# EAGLE design SMR (EAGLE 8.3.2)
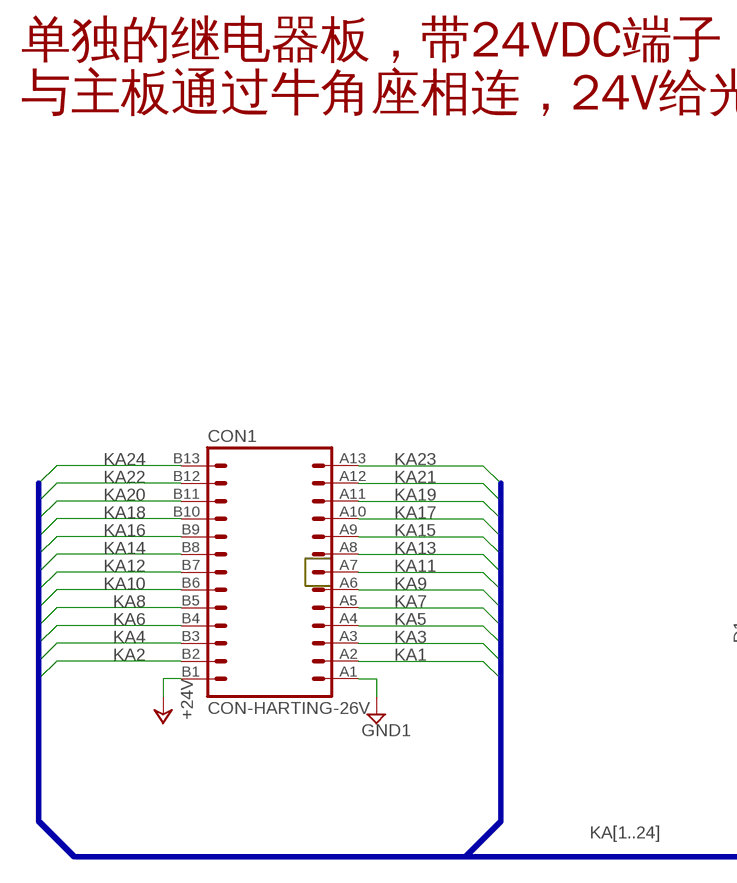
[diagram p0: schematic, sheet 1, part 1 of 2]
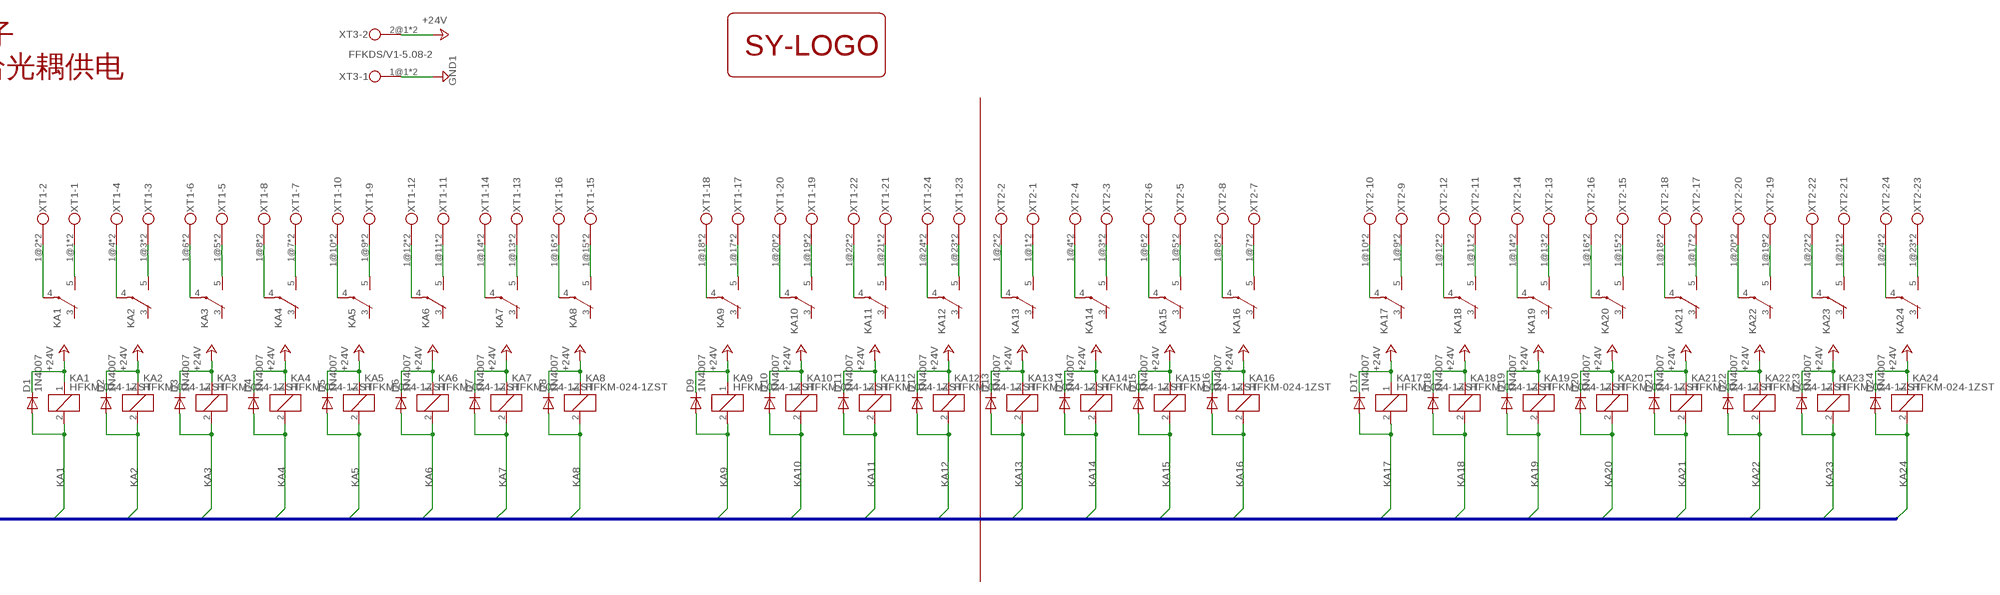
[diagram p1: schematic, sheet 1, part 2 of 2]

## Parts
CON1  CON-HARTING-26V  [26V]
D1  1N4007  [DO41-10]
D2  1N4007  [DO41-10]
D3  1N4007  [DO41-10]
D4  1N4007  [DO41-10]
D5  1N4007  [DO41-10]
D6  1N4007  [DO41-10]
D7  1N4007  [DO41-10]
D8  1N4007  [DO41-10]
D9  1N4007  [DO41-10]
D10  1N4007  [DO41-10]
D11  1N4007  [DO41-10]
D12  1N4007  [DO41-10]
D13  1N4007  [DO41-10]
D14  1N4007  [DO41-10]
D15  1N4007  [DO41-10]
D16  1N4007  [DO41-10]
D17  1N4007  [DO41-10]
D18  1N4007  [DO41-10]
D19  1N4007  [DO41-10]
D20  1N4007  [DO41-10]
D21  1N4007  [DO41-10]
D22  1N4007  [DO41-10]
D23  1N4007  [DO41-10]
D24  1N4007  [DO41-10]
KA1  HFKM-024-1ZST  [HFKM-1ZST]
KA2  HFKM-024-1ZST  [HFKM-1ZST]
KA3  HFKM-024-1ZST  [HFKM-1ZST]
KA4  HFKM-024-1ZST  [HFKM-1ZST]
KA5  HFKM-024-1ZST  [HFKM-1ZST]
KA6  HFKM-024-1ZST  [HFKM-1ZST]
KA7  HFKM-024-1ZST  [HFKM-1ZST]
KA8  HFKM-024-1ZST  [HFKM-1ZST]
KA9  HFKM-024-1ZST  [HFKM-1ZST]
KA10  HFKM-024-1ZST  [HFKM-1ZST]
KA11  HFKM-024-1ZST  [HFKM-1ZST]
KA12  HFKM-024-1ZST  [HFKM-1ZST]
KA13  HFKM-024-1ZST  [HFKM-1ZST]
KA14  HFKM-024-1ZST  [HFKM-1ZST]
KA15  HFKM-024-1ZST  [HFKM-1ZST]
KA16  HFKM-024-1ZST  [HFKM-1ZST]
KA17  HFKM-024-1ZST  [HFKM-1ZST]
KA18  HFKM-024-1ZST  [HFKM-1ZST]
KA19  HFKM-024-1ZST  [HFKM-1ZST]
KA20  HFKM-024-1ZST  [HFKM-1ZST]
KA21  HFKM-024-1ZST  [HFKM-1ZST]
KA22  HFKM-024-1ZST  [HFKM-1ZST]
KA23  HFKM-024-1ZST  [HFKM-1ZST]
KA24  HFKM-024-1ZST  [HFKM-1ZST]
LOGO1  SY-LOGO_BOTTOM  [SY-LOGO_BOTTOM]
XT1  FFKDS/V1-5.08-24  [FFKDS/V1-5.08-24]
XT2  FFKDS/V1-5.08-24  [FFKDS/V1-5.08-24]
XT3  FFKDS/V1-5.08-2  [FFKDS/V1-5.08-2]

## Nets
+24V: CON1.B1 D1.C D2.C D3.C D4.C D5.C D6.C D7.C D8.C D9.C D10.C D11.C D12.C D13.C D14.C D15.C D16.C D17.C D18.C D19.C D20.C D21.C D22.C D23.C D24.C KA1.1(COIL1) KA2.1(COIL1) KA3.1(COIL1) KA4.1(COIL1) KA5.1(COIL1) KA6.1(COIL1) KA7.1(COIL1) KA8.1(COIL1) KA9.1(COIL1) KA10.1(COIL1) KA11.1(COIL1) KA12.1(COIL1) KA13.1(COIL1) KA14.1(COIL1) KA15.1(COIL1) KA16.1(COIL1) KA17.1(COIL1) KA18.1(COIL1) KA19.1(COIL1) KA20.1(COIL1) KA21.1(COIL1) KA22.1(COIL1) KA23.1(COIL1) KA24.1(COIL1) XT3.2@1 XT3.2@2
GND1: CON1.A1 XT3.1@1 XT3.1@2
KA1: CON1.A2 D1.A KA1.2(COIL2)
KA2: CON1.B2 D2.A KA2.2(COIL2)
KA3: CON1.A3 D3.A KA3.2(COIL2)
KA4: CON1.B3 D4.A KA4.2(COIL2)
KA5: CON1.A4 D5.A KA5.2(COIL2)
KA6: CON1.B4 D6.A KA6.2(COIL2)
KA7: CON1.A5 D7.A KA7.2(COIL2)
KA8: CON1.B5 D8.A KA8.2(COIL2)
KA9: CON1.A6 D9.A KA9.2(COIL2)
KA10: CON1.B6 D10.A KA10.2(COIL2)
KA11: CON1.A7 D11.A KA11.2(COIL2)
KA12: CON1.B7 D12.A KA12.2(COIL2)
KA13: CON1.A8 D13.A KA13.2(COIL2)
KA14: CON1.B8 D14.A KA14.2(COIL2)
KA15: CON1.A9 D15.A KA15.2(COIL2)
KA16: CON1.B9 D16.A KA16.2(COIL2)
KA17: CON1.A10 D17.A KA17.2(COIL2)
KA18: CON1.B10 D18.A KA18.2(COIL2)
KA19: CON1.A11 D19.A KA19.2(COIL2)
KA20: CON1.B11 D20.A KA20.2(COIL2)
KA21: CON1.A12 D21.A KA21.2(COIL2)
KA22: CON1.B12 D22.A KA22.2(COIL2)
KA23: CON1.A13 D23.A KA23.2(COIL2)
KA24: CON1.B13 D24.A KA24.2(COIL2)
N$1: KA1.4(COM) XT1.1@2 XT1.2@2
N$2: KA1.5(NO) XT1.1@1 XT1.2@1
N$3: KA3.4(COM) XT1.1@6 XT1.2@6
N$4: KA3.5(NO) XT1.1@5 XT1.2@5
N$51: KA8.5(NO) XT1.1@15 XT1.2@15
N$52: KA8.4(COM) XT1.1@16 XT1.2@16
N$53: KA7.5(NO) XT1.1@13 XT1.2@13
N$54: KA7.4(COM) XT1.1@14 XT1.2@14
N$55: KA6.5(NO) XT1.1@11 XT1.2@11
N$56: KA6.4(COM) XT1.1@12 XT1.2@12
N$57: KA5.5(NO) XT1.1@9 XT1.2@9
N$58: KA5.4(COM) XT1.1@10 XT1.2@10
N$59: KA4.5(NO) XT1.1@7 XT1.2@7
N$60: KA4.4(COM) XT1.1@8 XT1.2@8
N$63: KA2.5(NO) XT1.1@3 XT1.2@3
N$64: KA2.4(COM) XT1.1@4 XT1.2@4
N$89: KA9.4(COM) XT1.1@18 XT1.2@18
N$90: KA9.5(NO) XT1.1@17 XT1.2@17
N$91: KA16.5(NO) XT2.1@7 XT2.2@7
N$92: KA16.4(COM) XT2.1@8 XT2.2@8
N$93: KA15.5(NO) XT2.1@5 XT2.2@5
N$94: KA15.4(COM) XT2.1@6 XT2.2@6
N$95: KA14.5(NO) XT2.1@3 XT2.2@3
N$96: KA14.4(COM) XT2.1@4 XT2.2@4
N$97: KA13.5(NO) XT2.1@1 XT2.2@1
N$98: KA13.4(COM) XT2.1@2 XT2.2@2
N$99: KA12.5(NO) XT1.1@23 XT1.2@23
N$100: KA12.4(COM) XT1.1@24 XT1.2@24
N$101: KA11.5(NO) XT1.1@21 XT1.2@21
N$102: KA11.4(COM) XT1.1@22 XT1.2@22
N$103: KA10.5(NO) XT1.1@19 XT1.2@19
N$104: KA10.4(COM) XT1.1@20 XT1.2@20
N$129: KA17.4(COM) XT2.1@10 XT2.2@10
N$130: KA17.5(NO) XT2.1@9 XT2.2@9
N$131: KA24.5(NO) XT2.1@23 XT2.2@23
N$132: KA24.4(COM) XT2.1@24 XT2.2@24
N$133: KA23.5(NO) XT2.1@21 XT2.2@21
N$134: KA23.4(COM) XT2.1@22 XT2.2@22
N$135: KA22.5(NO) XT2.1@19 XT2.2@19
N$136: KA22.4(COM) XT2.1@20 XT2.2@20
N$137: KA21.5(NO) XT2.1@17 XT2.2@17
N$138: KA21.4(COM) XT2.1@18 XT2.2@18
N$139: KA20.5(NO) XT2.1@15 XT2.2@15
N$140: KA20.4(COM) XT2.1@16 XT2.2@16
N$141: KA19.5(NO) XT2.1@13 XT2.2@13
N$142: KA19.4(COM) XT2.1@14 XT2.2@14
N$143: KA18.5(NO) XT2.1@11 XT2.2@11
N$144: KA18.4(COM) XT2.1@12 XT2.2@12
Unconnected: KA1.3(NC) KA2.3(NC) KA3.3(NC) KA4.3(NC) KA5.3(NC) KA6.3(NC) KA7.3(NC) KA8.3(NC) KA9.3(NC) KA10.3(NC) KA11.3(NC) KA12.3(NC) KA13.3(NC) KA14.3(NC) KA15.3(NC) KA16.3(NC) KA17.3(NC) KA18.3(NC) KA19.3(NC) KA20.3(NC) KA21.3(NC) KA22.3(NC) KA23.3(NC) KA24.3(NC)

## Buses
KA[1..24]

## Notes on the sheet
- 单独的继电器板，带24VDC端子
  与主板通过牛角座相连，24V给光耦供电

## Library data of the parts
CON1 = SHMT:CON-HARTING-26V: CONNECTOR; OC_FARNELL: unknown; OC_NEWARK: unknown
D1-D24 = SHMT:1N4007
KA1-KA24 = prj_snowmaker:HFKM-024-1ZST
LOGO1 = LOGO:SY-LOGO
XT1 XT2 = SHMT:FFKDS/V1-5.08-24
XT3 = SHMT:FFKDS/V1-5.08-2

## Board
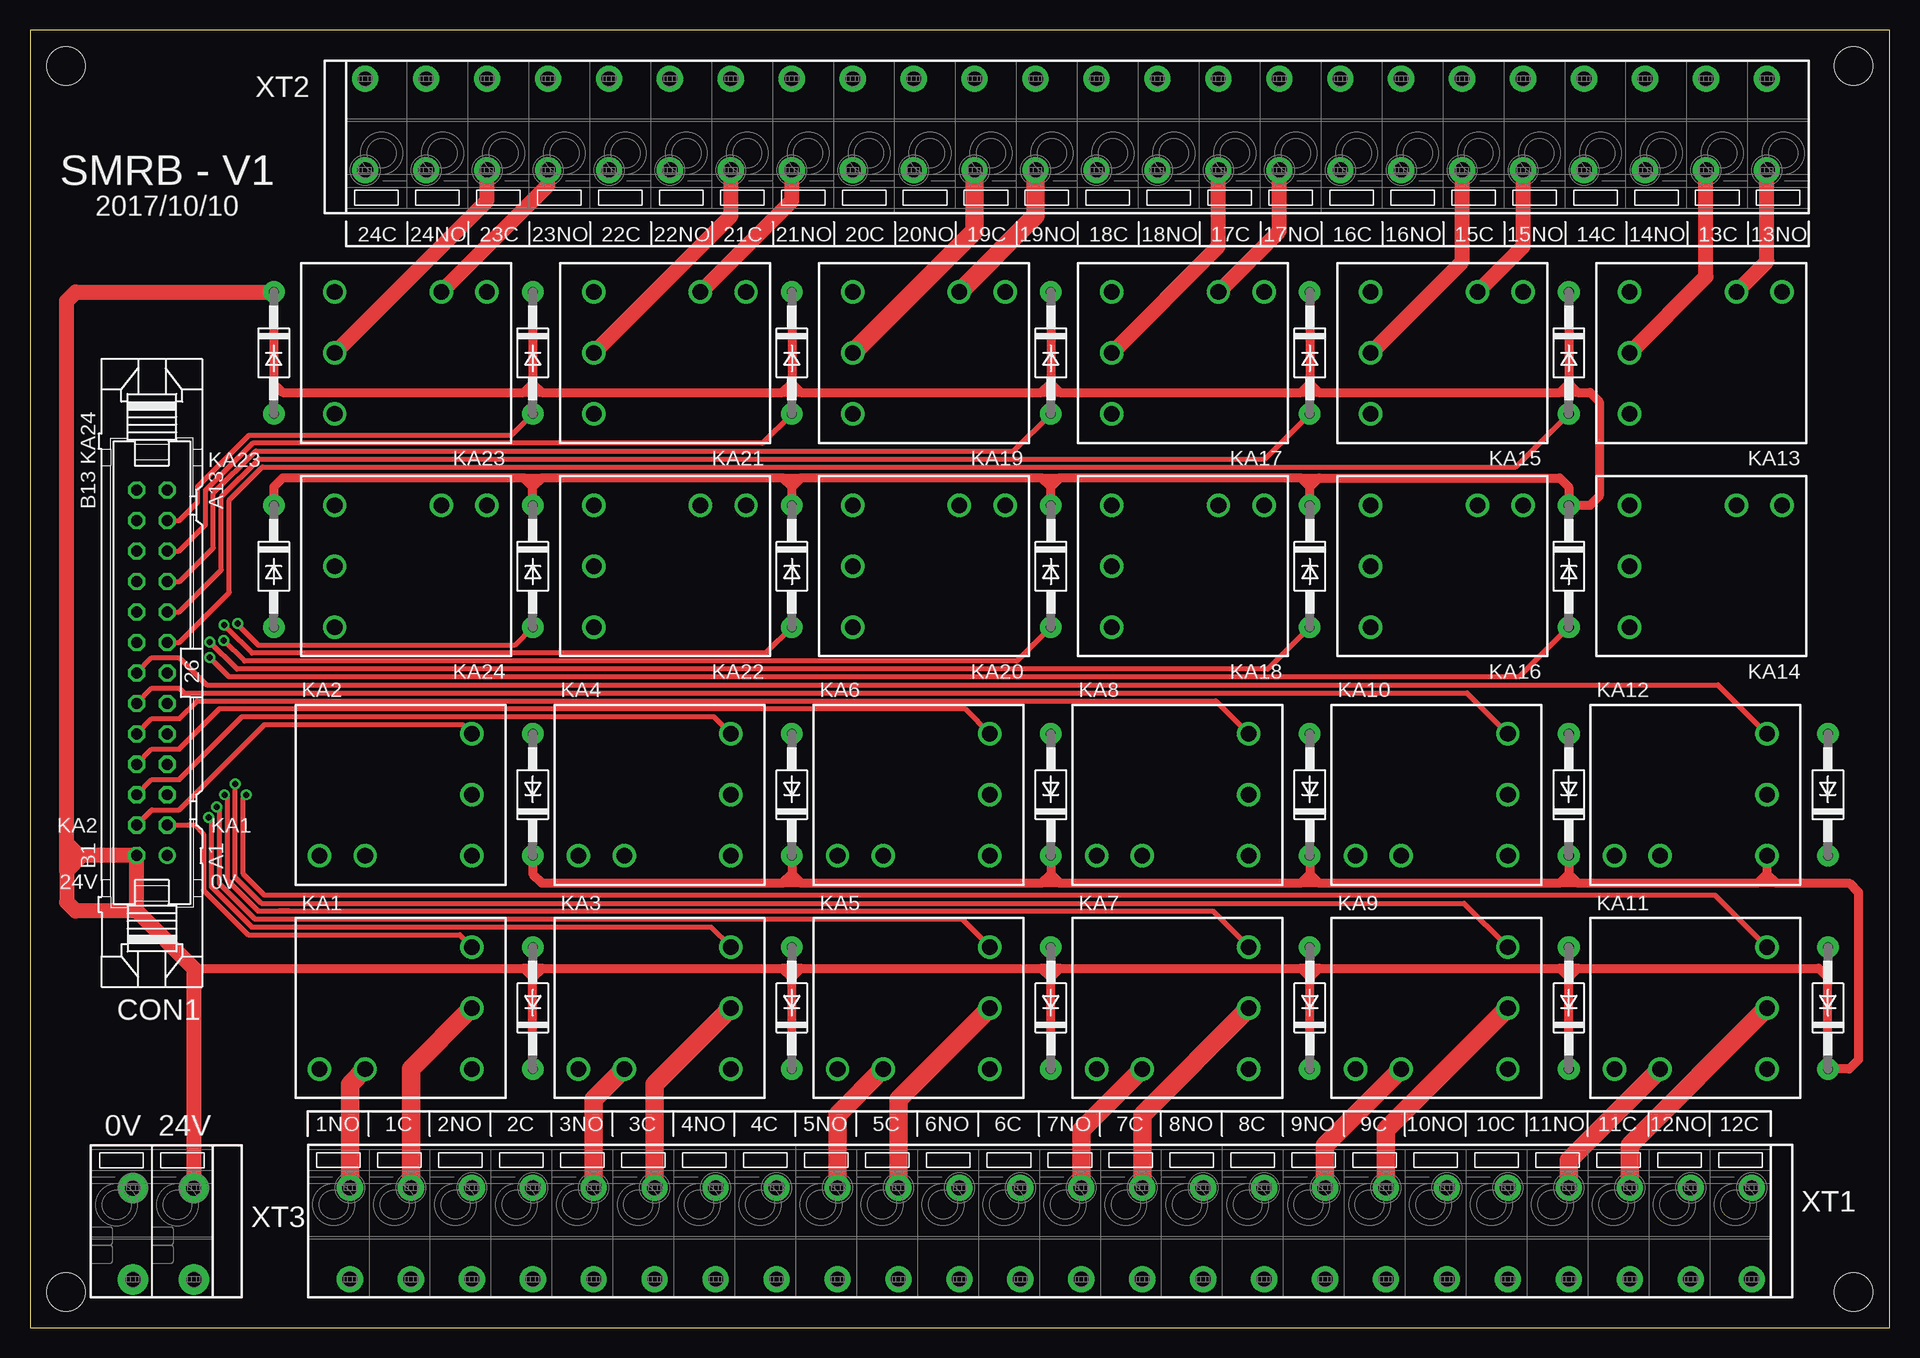
[diagram p2: board, top side]
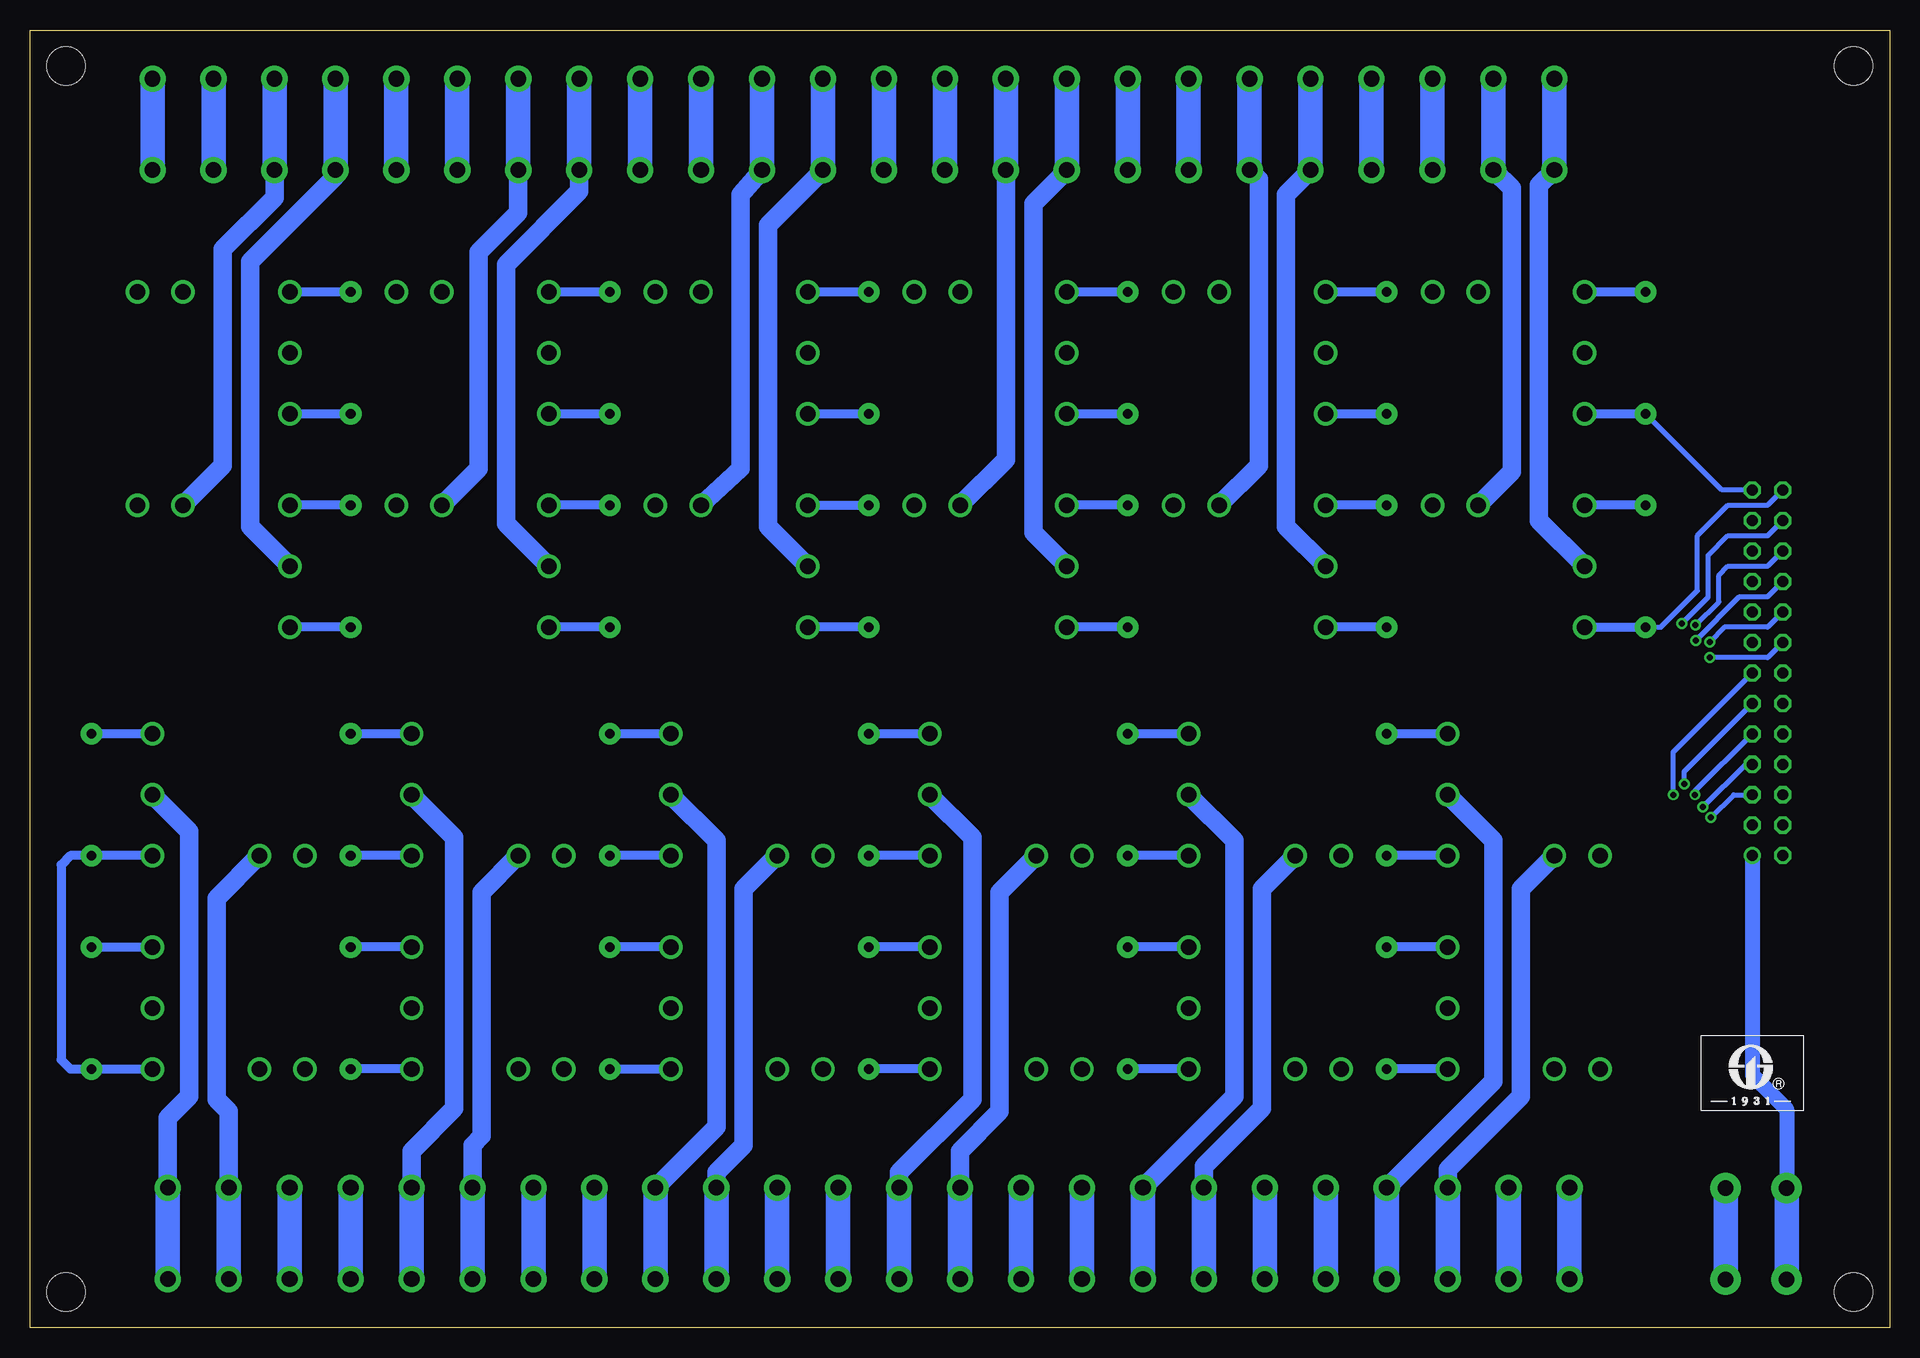
[diagram p3: board, bottom side, seen from below]

Size 155 x 108.2 mm. Coordinates in mm from the lower left corner, seen from the top.
Copper layers (1*16): Top 0.035mm / dielectric 1.5mm / Bottom 0.035mm
Design rules "default *": minimum track width 6mil, minimum drill 0.35mm, track to track 10mil, track to pad 10mil, pad to pad 10mil, via to via 6mil, smd to smd 10mil, copper to edge 40mil, drill to drill 6mil, minimum pad ring 10mil, minimum via ring 8mil, stop-mask expansion 4mil, vias tented up to drill 0mil, thermal gap 10mil

### Footprints (pad centres in the part's own frame; a part is rotated, then mirrored left to right if it is on the bottom)
26V = drill 0.914: A1 -15.24,-1.27 | drill 0.914 octagon: A2 -12.7,-1.27; A3 -10.16,-1.27; A4 -7.62,-1.27; A5 -5.08,-1.27; A6 -2.54,-1.27; A7 0,-1.27; A8 2.54,-1.27; A9 5.08,-1.27; A10 7.62,-1.27; A11 10.16,-1.27; A12 12.7,-1.27; A13 15.24,-1.27; B1 -15.24,1.27; B2 -12.7,1.27; B3 -10.16,1.27; B4 -7.62,1.27; B5 -5.08,1.27; B6 -2.54,1.27; B7 0,1.27; B8 2.54,1.27; B9 5.08,1.27; B10 7.62,1.27; B11 10.16,1.27; B12 12.7,1.27; B13 15.24,1.27
DO41-10 = drill 0.8 pad 1.8: A 5.08,0; C -5.08,0
HFKM-1ZST = drill 1.3: 1 0,5.08; 2 0,-5.08; 3 12.7,5.08; 4 0,0; 5 8.89,5.08
108.2-OUTLINE = hole 3.2: 3,3; 3,105.2; 152,105.2; 152,3
FFKDS/V1-5.08-24 = drill 1.3 pad 2.184: 1@1 0,7.62; 1@2 5.08,7.62; 1@3 10.16,7.62; 1@4 15.24,7.62; 1@5 20.32,7.62; 1@6 25.4,7.62; 1@7 30.48,7.62; 1@8 35.56,7.62; 1@9 40.64,7.62; 1@10 45.72,7.62; 1@11 50.8,7.62; 1@12 55.88,7.62; 1@13 60.96,7.62; 1@14 66.04,7.62; 1@15 71.12,7.62; 1@16 76.2,7.62; 1@17 81.28,7.62; 1@18 86.36,7.62; 1@19 91.44,7.62; 1@20 96.52,7.62; 1@21 101.6,7.62; 1@22 106.68,7.62; 1@23 111.76,7.62; 1@24 116.84,7.62; 2@1 0,0; 2@2 5.08,0; 2@3 10.16,0; 2@4 15.24,0; 2@5 20.32,0; 2@6 25.4,0; 2@7 30.48,0; 2@8 35.56,0; 2@9 40.64,0; 2@10 45.72,0; 2@11 50.8,0; 2@12 55.88,0; 2@13 60.96,0; 2@14 66.04,0; 2@15 71.12,0; 2@16 76.2,0; 2@17 81.28,0; 2@18 86.36,0; 2@19 91.44,0; 2@20 96.52,0; 2@21 101.6,0; 2@22 106.68,0; 2@23 111.76,0; 2@24 116.84,0
FFKDS/V1-5.08-2 = drill 1.3 pad 2.54: 1@1 -1.58,2.77; 1@2 -1.58,-4.85; 2@1 3.5,2.77; 2@2 3.5,-4.85

### Placement (x,y rotation side)
CON1  10.16,54.61 90 top
D1  41.91,26.67 90 top
D2  41.91,44.45 90 top
D3  63.5,26.67 90 top
D4  63.5,44.45 90 top
D5  85.09,26.67 90 top
D6  85.09,44.45 90 top
D7  106.68,26.67 90 top
D8  106.68,44.45 90 top
D9  128.27,26.67 90 top
D10  128.27,44.45 90 top
D11  149.86,26.67 90 top
D12  149.86,44.45 90 top
D13  128.27,81.28 270 top
D14  128.27,63.5 270 top
D15  106.68,81.28 270 top
D16  106.68,63.5 270 top
D17  85.09,81.28 270 top
D18  85.09,63.5 270 top
D19  63.5,81.28 270 top
D20  63.5,63.5 270 top
D21  41.91,81.28 270 top
D22  41.91,63.5 270 top
D23  20.32,81.28 270 top
D24  20.32,63.5 270 top
KA1  36.83,26.67 180 top
KA2  36.83,44.45 180 top
KA3  58.42,26.67 180 top
KA4  58.42,44.45 180 top
KA5  80.01,26.67 180 top
KA6  80.01,44.45 180 top
KA7  101.6,26.67 180 top
KA8  101.6,44.45 180 top
KA9  123.19,26.67 180 top
KA10  123.19,44.45 180 top
KA11  144.78,26.67 180 top
KA12  144.78,44.45 180 top
KA13  133.35,81.28 0 top
KA14  133.35,63.5 0 top
KA15  111.76,81.28 0 top
KA16  111.76,63.5 0 top
KA17  90.17,81.28 0 top
KA18  90.17,63.5 0 top
KA19  68.58,81.28 0 top
KA20  68.58,63.5 0 top
KA21  46.99,81.28 0 top
KA22  46.99,63.5 0 top
KA23  25.4,81.28 0 top
KA24  25.4,63.5 0 top
LOGO1  11.43,21.59 0 top
U$1  [108.2-OUTLINE]  0,0 0 top
XT1  26.67,4.06 0 top
XT2  144.78,104.14 180 top
XT3  10.16,8.89 0 top

### Tracks (layer width: path | path; a pad name or v marks a point on that pad's centre or on a via)
+24V
  Top 0.762: D23.C 20.32,78.74 21.08,77.98 41.15,77.98 | 41.91,78.74 41.15,77.98 | 85.85,77.98 84.33,77.98 | 85.85,77.98 105.92,77.98 | 64.26,77.98 62.74,77.98 | 64.26,77.98 84.33,77.98 | 42.67,77.98 62.74,77.98 | 42.67,77.98 41.15,77.98 | 107.44,77.98 105.92,77.98 | 107.44,77.98 127.51,77.98 | 127.51,77.98 128.27,78.74 | 106.68,78.74 105.92,77.98 | D15.C 106.68,78.74 | 106.68,78.74 107.44,77.98 | 85.09,78.74 84.33,77.98 | D17.C 85.09,78.74 | 85.09,78.74 85.85,77.98 | 63.5,78.74 62.74,77.98 | D19.C 63.5,78.74 | 63.5,78.74 64.26,77.98 | D21.C 41.91,78.74 | 41.91,78.74 42.67,77.98 | 129.03,77.98 127.51,77.98 | 106.68,70.1 107.44,70.87 | 107.44,70.87 127.51,70.87 128.27,70.1 D14.C 130.05,68.58 130.81,69.34 130.81,77.22 130.05,77.98 129.03,77.98 | 105.92,70.87 107.44,70.87 | 105.92,70.87 85.85,70.87 | 85.85,70.87 85.09,70.1 | 84.33,70.87 85.85,70.87 | 84.33,70.87 64.26,70.87 | 64.26,70.87 63.5,70.1 | 62.74,70.87 64.26,70.87 | 62.74,70.87 42.67,70.87 | 42.67,70.87 41.91,70.1 | 41.15,70.87 42.67,70.87 | 41.15,70.87 21.08,70.87 20.32,70.1 D24.C | D22.C 41.91,70.1 | 41.91,70.1 41.15,70.87 | D20.C 63.5,70.1 | 63.5,70.1 62.74,70.87 | D18.C 85.09,70.1 | 85.09,70.1 84.33,70.87 | D16.C 106.68,70.1 | 106.68,70.1 105.92,70.87 | D13.C 128.27,78.74 | 128.27,78.74 129.03,77.98 | 13.66,29.97 41.15,29.97 | 41.15,29.97 41.91,29.21 | 42.67,29.97 41.15,29.97 | 42.67,29.97 62.74,29.97 | 62.74,29.97 63.5,29.21 | 64.26,29.97 62.74,29.97 | 64.26,29.97 84.33,29.97 | 84.33,29.97 85.09,29.21 | 85.85,29.97 84.33,29.97 | 85.85,29.97 105.92,29.97 | 105.92,29.97 106.68,29.21 | 107.44,29.97 105.92,29.97 | 107.44,29.97 127.51,29.97 | 127.51,29.97 128.27,29.21 | 129.03,29.97 127.51,29.97 | 129.03,29.97 149.1,29.97 149.86,29.21 D11.C 151.64,21.59 152.4,22.35 152.4,36.32 151.64,37.08 145.54,37.08
  Top 0.762: D2.C 41.91,37.85 42.67,37.08 62.74,37.08 | 63.5,37.85 62.74,37.08 | 64.26,37.08 62.74,37.08 | 64.26,37.08 84.33,37.08 | 84.33,37.08 85.09,37.85 | 85.85,37.08 84.33,37.08 | 85.85,37.08 105.92,37.08 | 105.92,37.08 106.68,37.85 | 107.44,37.08 105.92,37.08 | 107.44,37.08 127.51,37.08 | 127.51,37.08 128.27,37.85 | 129.03,37.08 127.51,37.08 | 129.03,37.08 144.02,37.08 | 144.02,37.08 144.78,37.85 | D10.C 128.27,37.85 | 128.27,37.85 129.03,37.08 | D8.C 106.68,37.85 | 106.68,37.85 107.44,37.08 | D6.C 85.09,37.85 | 85.09,37.85 85.85,37.08 | D4.C 63.5,37.85 | 63.5,37.85 64.26,37.08 | D1.C 41.91,29.21 | 41.91,29.21 42.67,29.97 | D3.C 63.5,29.21 | 63.5,29.21 64.26,29.97 | D5.C 85.09,29.21 | 85.09,29.21 85.85,29.97 | D7.C 106.68,29.21 | 106.68,29.21 107.44,29.97 | D9.C 128.27,29.21 | 128.27,29.21 129.03,29.97 | 145.54,37.08 144.02,37.08 | KA12.1 144.78,37.85 | 144.78,37.85 145.54,37.08
  Top 1.27: 8.89,34.74 CON1.B1 | 8.89,34.74 13.66,29.97 XT3.2@1 | 8.89,34.74 3.81,34.74 3.05,35.5 3.05,38.1 | D23.C 3.81,86.36 3.05,85.6 3.05,40.39 | 3.05,38.1 3.05,40.39 | CON1.B1 4.06,39.37 3.05,40.39 | CON1.B1 4.32,39.37 3.05,38.1
  Bottom 0.762: KA4.1 D4.C | KA1.1 D1.C | KA3.1 D3.C | KA5.1 D5.C | KA6.1 D6.C | KA12.1 D12.C 151.64,39.37 152.4,38.61 152.4,22.35 151.64,21.59 D11.C KA11.1 | KA10.1 D10.C | KA8.1 D8.C | D21.C KA21.1 | D23.C KA23.1 | D24.C KA24.1 | D22.C KA22.1 | D17.C KA17.1 | KA18.1 D18.C | D15.C KA15.1 | D16.C KA16.1 | D13.C KA13.1 | D14.C KA14.1 | D7.C KA7.1 | KA9.1 D9.C | D19.C KA19.1 | D20.C KA20.1 | KA2.1 D2.C
  Bottom 2.032: XT3.2@2 XT3.2@1
GND1
  Bottom 1.27: CON1.A1 11.43,21.08 8.58,18.23 XT3.1@1
  Bottom 2.032: XT3.1@1 XT3.1@2
KA1
  Top 0.406: KA1.2 35.81,32.77 18.19,32.77 14.48,36.48 14.48,41.15 13.72,41.91 CON1.A2
  Bottom 0.762: KA1.2 D1.A
KA2
  Top 0.406: CON1.B2 10.16,43.18 12.45,43.18 19.56,50.29 36.07,50.29 KA2.2
  Bottom 0.762: KA2.2 D2.A
KA3  (via drill 0.5)
  Top 0.406: KA3.2 56.74,33.43 18.46,33.43 15.14,36.75 15.14,42.3 v14.89,42.55
  Bottom 0.406: v14.89,42.55 12.98,44.45 CON1.A3
  Bottom 0.762: KA3.2 D3.A
KA4
  Top 0.406: CON1.B3 10.16,45.72 12.45,45.72 17.68,50.95 36.23,50.95 36.24,50.96 56.99,50.96 KA4.2
  Bottom 0.762: KA4.2 D4.A
KA5  (via drill 0.5)
  Top 0.406: KA5.2 77.67,34.09 18.74,34.09 15.8,37.02 15.8,43.18 v15.55,43.43
  Bottom 0.406: v15.55,43.43 11.99,46.99 CON1.A4
  Bottom 0.762: KA5.2 D5.A
KA6
  Top 0.406: CON1.B4 10.16,48.26 12.45,48.26 15.81,51.62 77.92,51.62 KA6.2
  Bottom 0.762: KA6.2 D6.A
KA7  (via drill 0.5)
  Top 0.406: KA7.2 98.6,34.75 21.59,34.75 | 21.59,34.75 20.73,34.75 | 21.59,34.75 19.01,34.75 16.46,37.3 16.46,44.2 v16.21,44.45
  Bottom 0.406: v16.21,44.45 16.21,44.75 CON1.A5
  Bottom 0.762: KA7.2 D7.A
KA8
  Top 0.406: CON1.B5 10.16,50.8 12.45,50.8 13.93,52.28 98.85,52.28 KA8.2
  Bottom 0.762: KA8.2 D8.A
KA9  (via drill 0.5)
  Top 0.406: KA9.2 119.53,35.41 19.28,35.41 17.12,37.57 v17.12,45.34 | v17.12,45.34
  Bottom 0.406: v17.12,45.34 17.12,46.38 CON1.A6
  Bottom 0.762: KA9.2 D9.A
KA10
  Top 0.406: CON1.B6 10.16,53.34 12.45,53.34 12.84,52.94 119.78,52.94 KA10.2
  Bottom 0.762: KA10.2 D10.A
KA11  (via drill 0.5)
  Top 0.406: KA11.2 140.46,36.07 19.56,36.07 17.78,37.85 17.78,44.2 v18.03,44.45
  Bottom 0.406: v18.03,44.45 18.03,48.01 CON1.A7
  Bottom 0.762: D11.A KA11.2
KA12
  Top 0.406: CON1.B7 10.16,55.88 12.45,55.88 14.72,53.6 140.71,53.6 KA12.2
  Bottom 0.762: KA12.2 D12.A
KA13
  Top 0.406: D13.A 123.85,71.78 19.36,71.78 16.61,69.03 16.61,61.32 12.45,57.15 CON1.A8
  Bottom 0.762: D13.A KA13.2
KA14  (via drill 0.5)
  Top 0.406: D14.A 124.11,54.26 16.6,54.26 v14.99,55.88
  Bottom 0.406: CON1.B8 10.16,55.88 v14.99,55.88
  Bottom 0.762: D14.A KA14.2
KA15
  Top 0.406: D15.A 102.92,72.44 19.09,72.44 15.95,69.3 15.95,63.2 12.45,59.69 CON1.A9
  Bottom 0.762: D15.A KA15.2
KA16  (via drill 0.5)
  Top 0.406: D16.A 103.19,54.92 17.25,54.92 v14.99,57.19
  Bottom 0.406: CON1.B9 10.16,58.42 13.76,58.42 v14.99,57.19
  Bottom 0.762: D16.A KA16.2
KA17
  Top 0.406: D17.A 81.99,73.1 18.82,73.1 15.29,69.58 15.29,65.02 12.5,62.23 CON1.A10
  Bottom 0.762: D17.A KA17.2
KA18  (via drill 0.5)
  Top 0.406: D18.A 82.25,55.59 17.88,55.59 v16.16,57.31
  Bottom 0.406: CON1.B10 10.16,60.96 12.51,60.96 v16.16,57.31
  Bottom 0.762: D18.A KA18.2
KA19
  Top 0.406: D19.A 61.06,73.76 18.54,73.76 14.63,69.85 14.63,66.95 12.45,64.77 CON1.A11
  Bottom 0.762: D19.A KA19.2
KA20  (via drill 0.5)
  Top 0.406: D20.A 61.33,56.24 18.51,56.24 16.54,58.22 | 16.54,58.22 | 16.54,58.22 v16.17,58.59
  Bottom 0.406: CON1.B11 10.16,63.5 13.46,63.5 14.22,62.74 14.22,60.53 v16.17,58.59
  Bottom 0.762: D20.A KA20.2
KA21
  Top 0.406: CON1.A12 12.45,67.31 13.97,68.83 13.97,70.12 18.27,74.42 40.13,74.42 D21.A
  Bottom 0.762: D21.A KA21.2
KA22  (via drill 0.5)
  Top 0.406: D22.A 40.4,56.91 19.05,56.91 17.32,58.64 v17.32,58.72
  Bottom 0.406: CON1.B12 10.16,66.04 13.46,66.04 15.11,64.39 15.11,60.93 v17.32,58.72
  Bottom 0.762: D22.A KA22.2
KA23
  Bottom 0.406: CON1.A13 13.97,69.85 D23.A
  Bottom 0.762: D23.A KA23.2
KA24
  Bottom 0.406: CON1.B13 10.16,68.58 13.46,68.58 16,66.04 16,61.47 19.05,58.42 D24.A
  Bottom 0.762: KA24.2 D24.A
N$1
  Top 1.524: XT1.1@2 31.75,21.59 KA1.4
  Bottom 2.032: XT1.2@2 XT1.1@2
N$2
  Top 1.524: XT1.1@1 26.67,20.32 KA1.5
  Bottom 2.032: XT1.2@1 XT1.1@1
N$3
  Top 1.524: XT1.1@6 52.07,20.32 KA3.4
  Bottom 2.032: XT1.2@6 XT1.1@6
N$4
  Top 1.524: XT1.1@5 46.99,19.05 KA3.5
  Bottom 2.032: XT1.2@5 XT1.1@5
N$51
  Bottom 1.524: XT1.1@15 97.79,12.95 95.5,15.24 95.5,36.58 KA8.5
  Bottom 2.032: XT1.2@15 XT1.1@15
N$52
  Bottom 1.524: XT1.1@16 97.79,16.76 97.79,40.64 KA8.4
  Bottom 2.032: XT1.2@16 XT1.1@16
N$53
  Top 1.524: XT1.1@13 87.63,16.51 KA7.5
  Bottom 2.032: XT1.2@13 XT1.1@13
N$54
  Top 1.524: XT1.1@14 92.71,17.78 KA7.4
  Bottom 2.032: XT1.2@14 XT1.1@14
N$55
  Bottom 1.524: XT1.1@11 77.47,14.73 74.17,18.03 74.17,36.32 KA6.5
  Bottom 2.032: XT1.2@11 XT1.1@11
N$56
  Bottom 1.524: XT1.1@12 82.55,12.95 76.45,19.05 76.45,40.89 KA6.4
  Bottom 2.032: XT1.2@12 XT1.1@12
N$57
  Top 1.524: XT1.1@9 67.31,17.78 KA5.5
  Bottom 2.032: XT1.2@9 XT1.1@9
N$58
  Top 1.524: XT1.1@10 72.39,19.05 KA5.4
  Bottom 2.032: XT1.2@10 XT1.1@10
N$59
  Bottom 1.524: KA4.5 52.32,36.58 52.32,18.29 57.15,13.46 XT1.1@7
  Bottom 2.032: XT1.2@7 XT1.1@7
N$60
  Bottom 1.524: XT1.1@8 54.61,19.3 54.61,40.64 KA4.4
  Bottom 2.032: XT1.2@8 XT1.1@8
N$63
  Bottom 1.524: KA2.5 30.73,36.58 30.73,19.3 36.83,13.21 XT1.1@3
  Bottom 2.032: XT1.2@3 XT1.1@3
N$64
  Bottom 1.524: KA2.4 33.02,40.64 33.02,20.57 XT1.1@4
  Bottom 2.032: XT1.2@4 XT1.1@4
N$89
  Top 1.524: XT1.1@18 113.03,16.51 KA9.4
  Bottom 2.032: XT1.2@18 XT1.1@18
N$90
  Top 1.524: XT1.1@17 107.95,15.24 KA9.5
  Bottom 2.032: XT1.2@17 XT1.1@17
N$91
  Bottom 1.524: KA16.5 117.6,71.63 117.6,89.66 114.3,92.96 XT2.1@7
  Bottom 2.032: XT2.1@7 XT2.2@7
N$92
  Bottom 1.524: KA16.4 115.32,67.06 115.32,88.65 109.22,94.74 XT2.1@8
  Bottom 2.032: XT2.1@8 XT2.2@8
N$93
  Top 1.27: KA15.5 124.46,90.17 XT2.1@5
  Bottom 2.032: XT2.1@5 XT2.2@5
N$94
  Top 1.27: KA15.4 119.38,88.9 XT2.1@6
  Bottom 2.032: XT2.1@6 XT2.2@6
N$95
  Bottom 1.524: KA14.5 138.94,71.88 138.94,89.92 134.62,94.23 XT2.1@3
  Bottom 2.032: XT2.1@3 XT2.2@3
N$96
  Bottom 1.524: KA14.4 136.65,66.8 136.65,88.9 129.54,96.01 XT2.1@4
  Bottom 2.032: XT2.1@4 XT2.2@4
N$97
  Top 1.27: KA13.5 144.78,88.9 XT2.1@1
  Bottom 2.032: XT2.1@1 XT2.2@1
N$98
  Top 1.27: KA13.4 139.7,87.63 XT2.1@2
  Bottom 2.032: XT2.1@2 XT2.2@2
N$99
  Bottom 1.524: XT1.1@23 138.43,18.03 139.45,19.05 139.45,35.81 KA12.5
  Bottom 2.032: XT1.2@23 XT1.1@23
N$100
  Bottom 1.524: XT1.1@24 143.51,17.53 141.73,19.3 141.73,41.4 KA12.4
  Bottom 2.032: XT1.2@24 XT1.1@24
N$101
  Top 1.524: XT1.1@21 128.27,13.97 KA11.5
  Bottom 2.032: XT1.2@21 XT1.1@21
N$102
  Top 1.524: XT1.1@22 133.35,15.24 KA11.4
  Bottom 2.032: XT1.2@22 XT1.1@22
N$103
  Bottom 1.524: XT1.1@19 118.11,15.24 117.35,16 117.35,36.32 KA10.5
  Bottom 2.032: XT1.2@19 XT1.1@19
N$104
  Bottom 1.524: XT1.1@20 123.19,14.73 119.63,18.29 119.63,40.89 KA10.4
  Bottom 2.032: XT1.2@20 XT1.1@20
N$129
  Top 1.27: KA17.4 99.06,90.17 XT2.1@10
  Bottom 2.032: XT2.1@10 XT2.2@10
N$130
  Top 1.27: KA17.5 104.14,91.44 XT2.1@9
  Bottom 2.032: XT2.1@9 XT2.2@9
N$131
  Bottom 1.524: XT2.1@23 31.5,95 31.5,71.37 KA24.5
  Bottom 2.032: XT2.2@23 XT2.1@23
N$132
  Bottom 1.524: KA24.4 29.21,67.31 29.21,95.25 XT2.1@24
  Bottom 2.032: XT2.1@24 XT2.2@24
N$133
  Top 1.27: KA23.5 43.18,95.25 XT2.1@21
  Bottom 2.032: XT2.1@21 XT2.2@21
N$134
  Top 1.27: KA23.4 38.1,93.98 XT2.1@22
  Bottom 2.032: XT2.1@22 XT2.2@22
N$135
  Bottom 1.524: KA22.5 52.58,71.88 52.58,95.76 XT2.1@19
  Bottom 2.032: XT2.1@19 XT2.2@19
N$136
  Bottom 1.524: KA22.4 50.29,66.8 50.29,94.49 XT2.1@20
  Bottom 2.032: XT2.1@20 XT2.2@20
N$137
  Top 1.27: KA21.5 63.5,93.98 XT2.1@17
  Bottom 2.032: XT2.1@17 XT2.2@17
N$138
  Top 1.27: KA21.4 58.42,92.71 XT2.1@18
  Bottom 2.032: XT2.1@18 XT2.2@18
N$139
  Bottom 1.524: XT2.1@15 73.66,72.39 KA20.5
  Bottom 2.032: XT2.2@15 XT2.1@15
N$140
  Bottom 1.524: KA20.4 71.37,66.29 71.37,93.73 XT2.1@16
  Bottom 2.032: XT2.1@16 XT2.2@16
N$141
  Top 1.524: KA19.5 83.82,92.71 XT2.1@13
  Bottom 2.032: XT2.1@13 XT2.2@13
N$142
  Top 1.524: KA19.4 78.74,91.44 XT2.1@14
  Bottom 2.032: XT2.1@14 XT2.2@14
N$143
  Bottom 1.524: KA18.5 95.76,71.63 95.76,94.49 XT2.1@11
  Bottom 2.032: XT2.2@11 XT2.1@11
N$144
  Bottom 1.524: XT2.1@12 93.47,91.95 93.47,66.8 KA18.4
  Bottom 2.032: XT2.2@12 XT2.1@12

### Text on the board
tPlace: SMRB - V1 | 2017/10/10 | 24C | 24NO | 23C | 23NO | 22C | 22NO | 21C | 21NO | 20C | 20NO | 19C | 19NO | 18C | 18NO | 17C | 17NO | 16C | 16NO | 15C | 15NO | 14C | 14NO | 13C | 13NO | KA24 | KA23 | KA2 | KA1 | 24V | 0V | 1NO | 1C | 2NO | 2C | 3NO | 3C | 4NO | 4C | 5NO | 5C | 6NO | 6C | 7NO | 7C | 8NO | 8C | 9NO | 9C | 10NO | 10C | 11NO | 11C | 12NO | 12C | 0V 24V